# EAGLE board design (EAGLE 7.7.0)
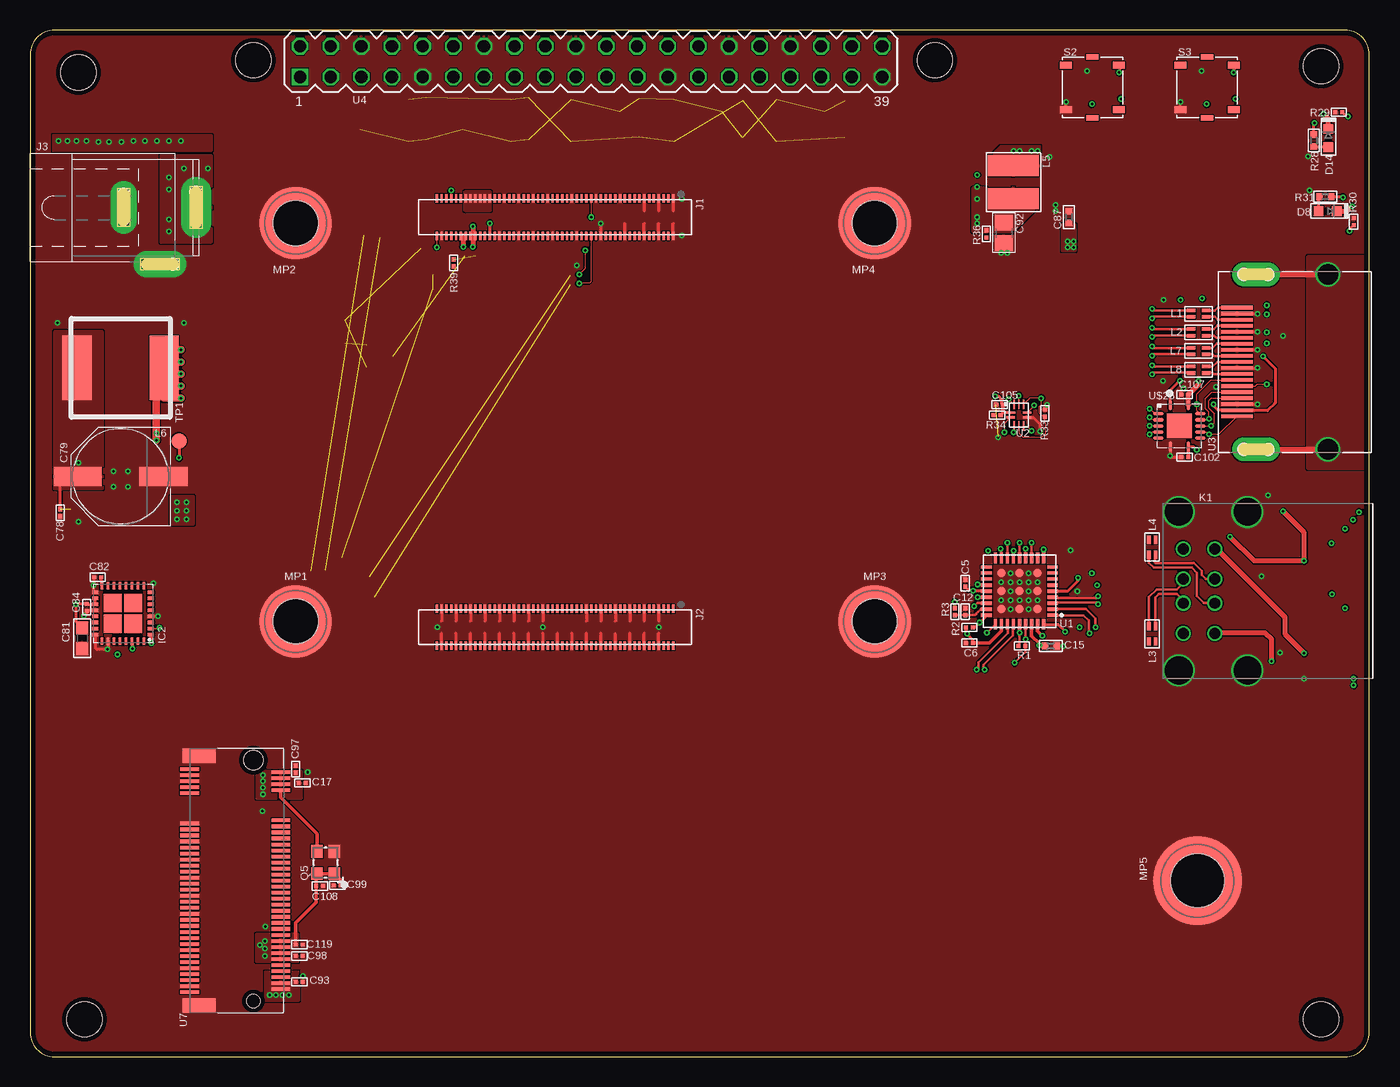
[diagram p17: board, top side]
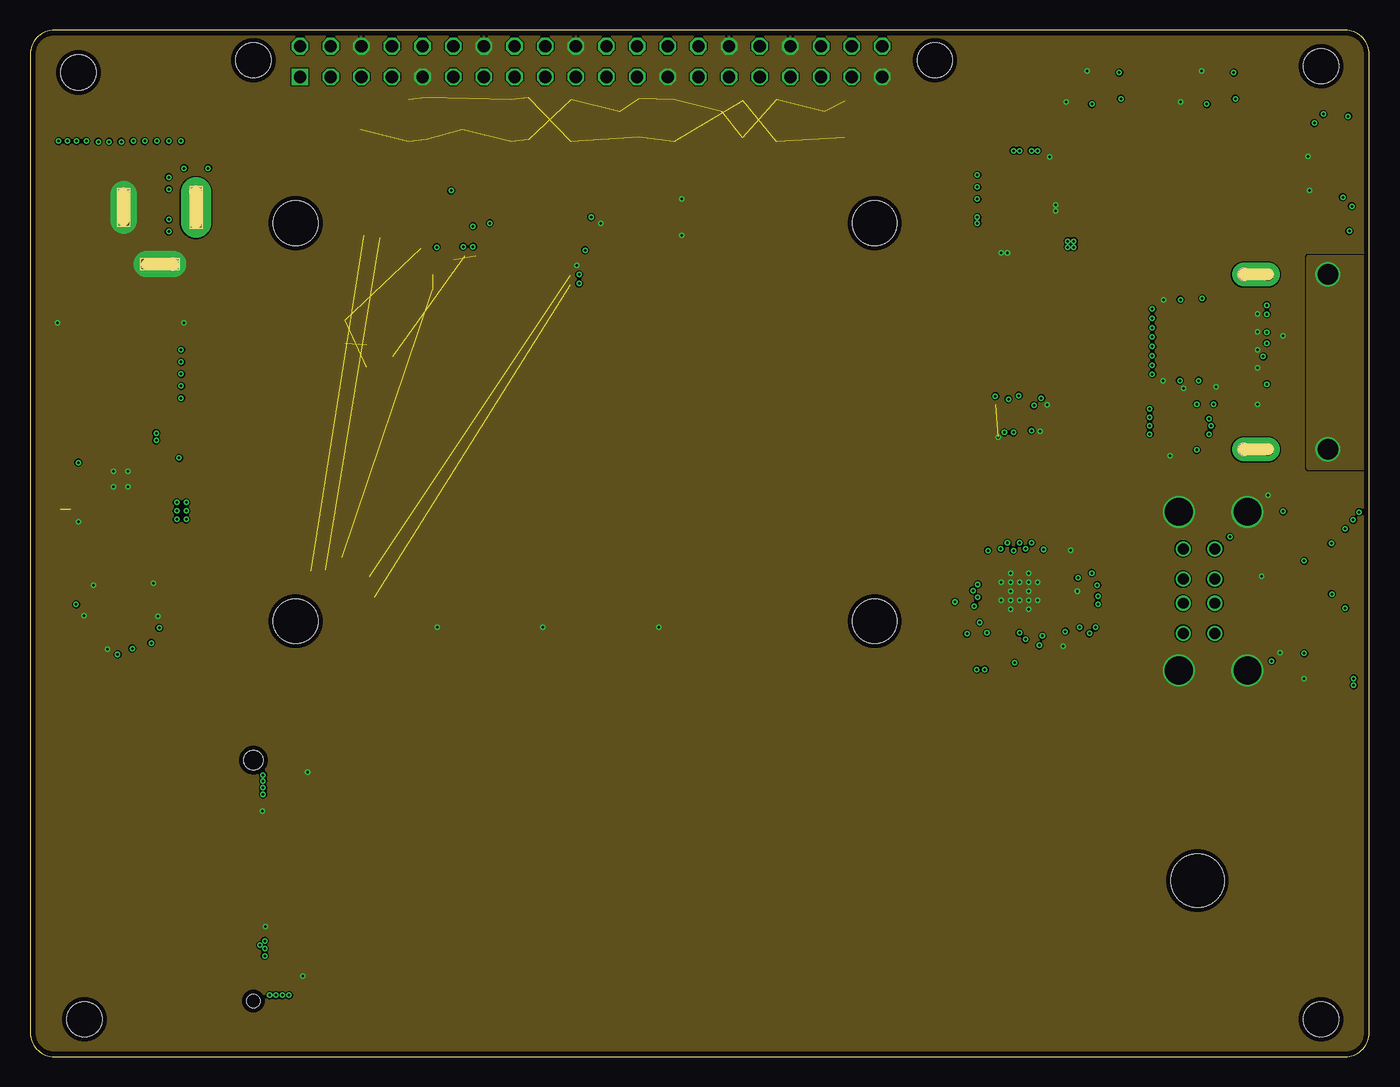
[diagram p18: board, inner layer GND]
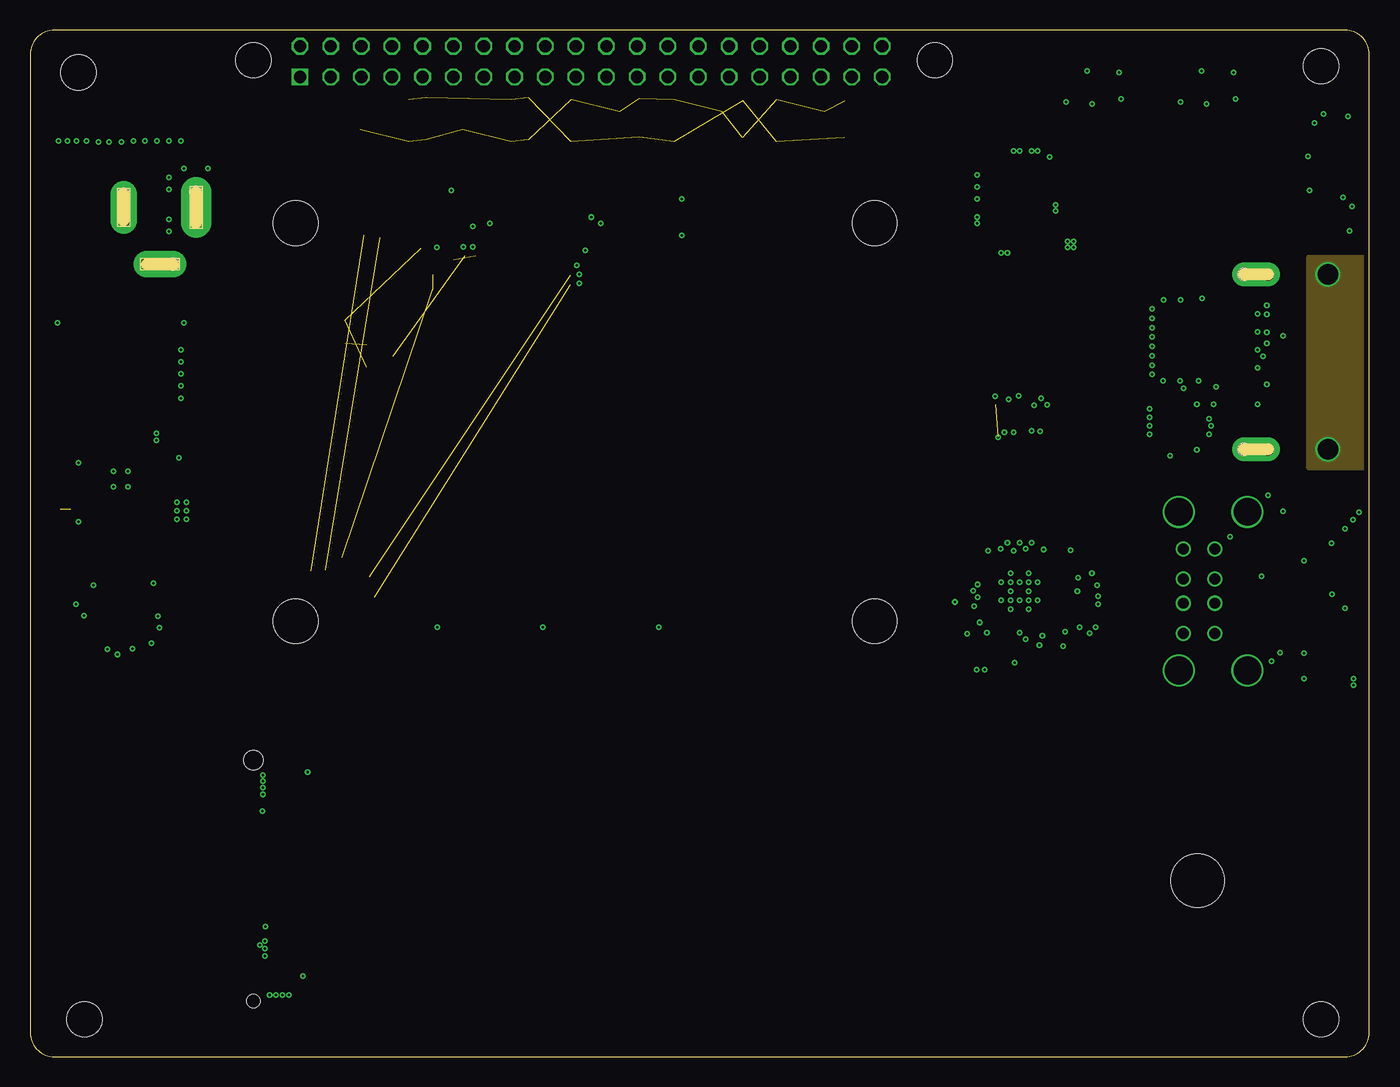
[diagram p19: board, inner layer S3]
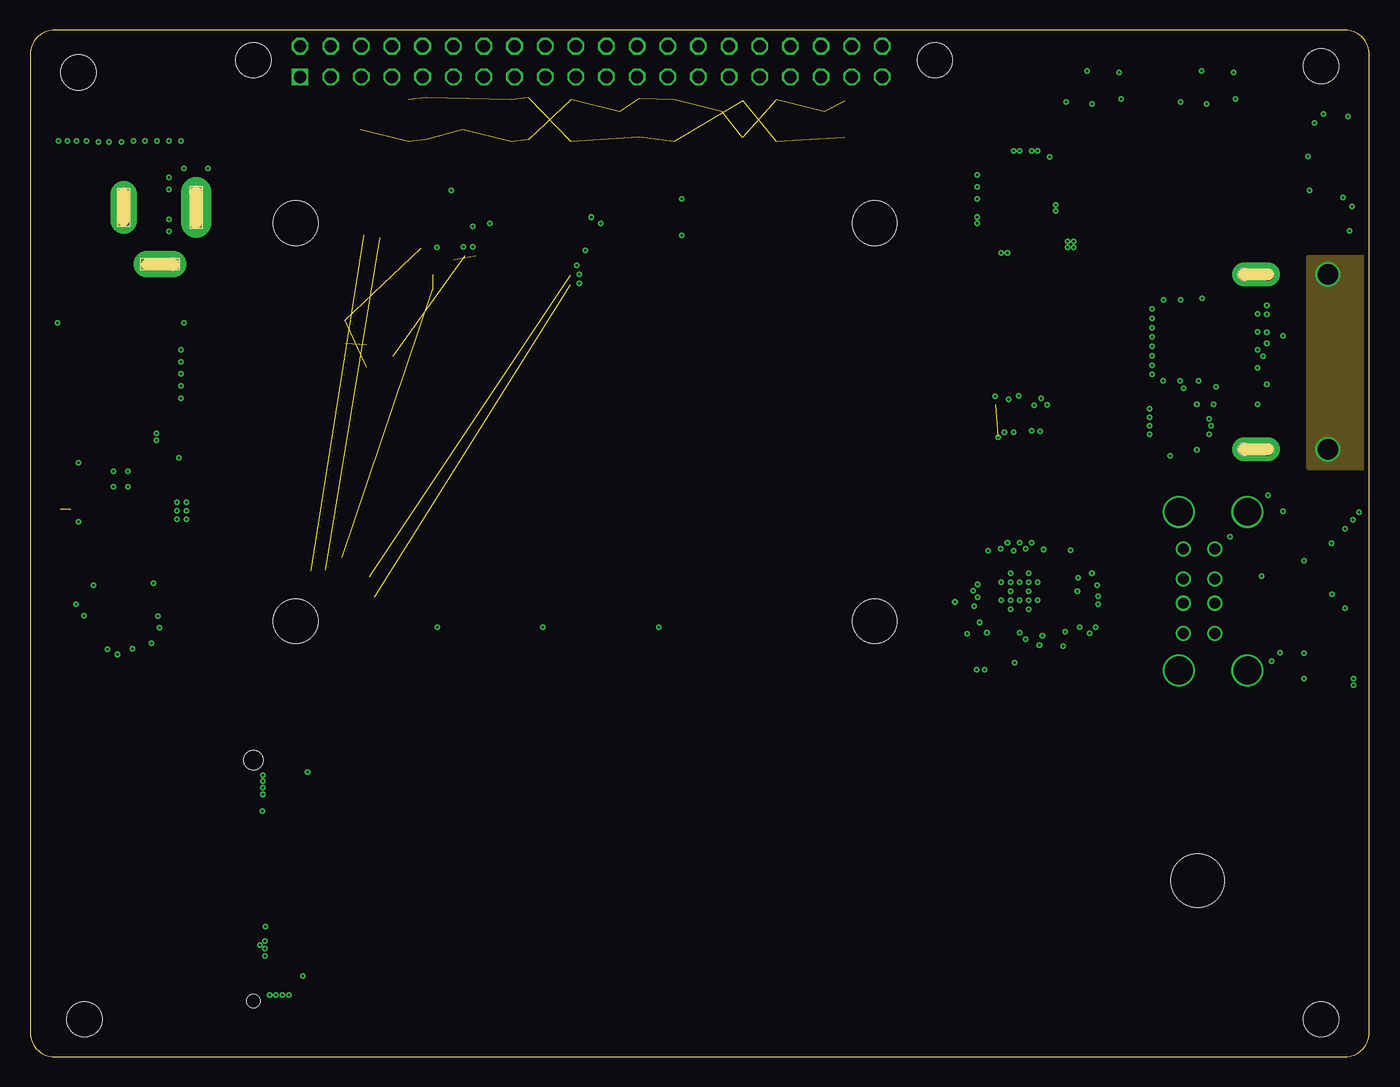
[diagram p20: board, inner layer S14]
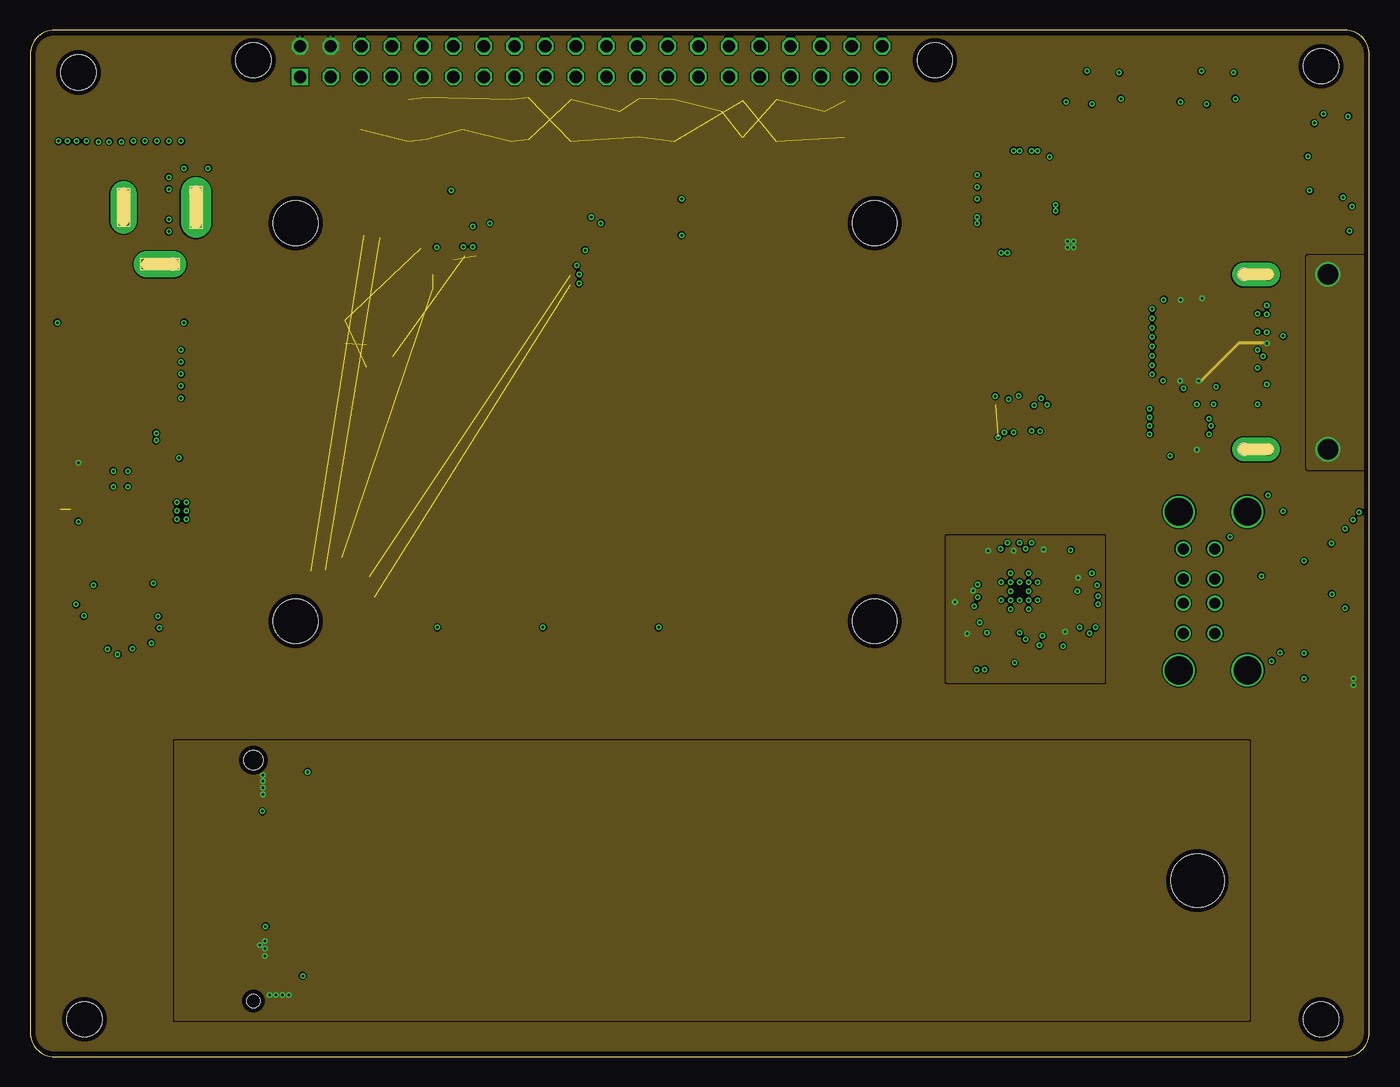
[diagram p21: board, inner layer Power]
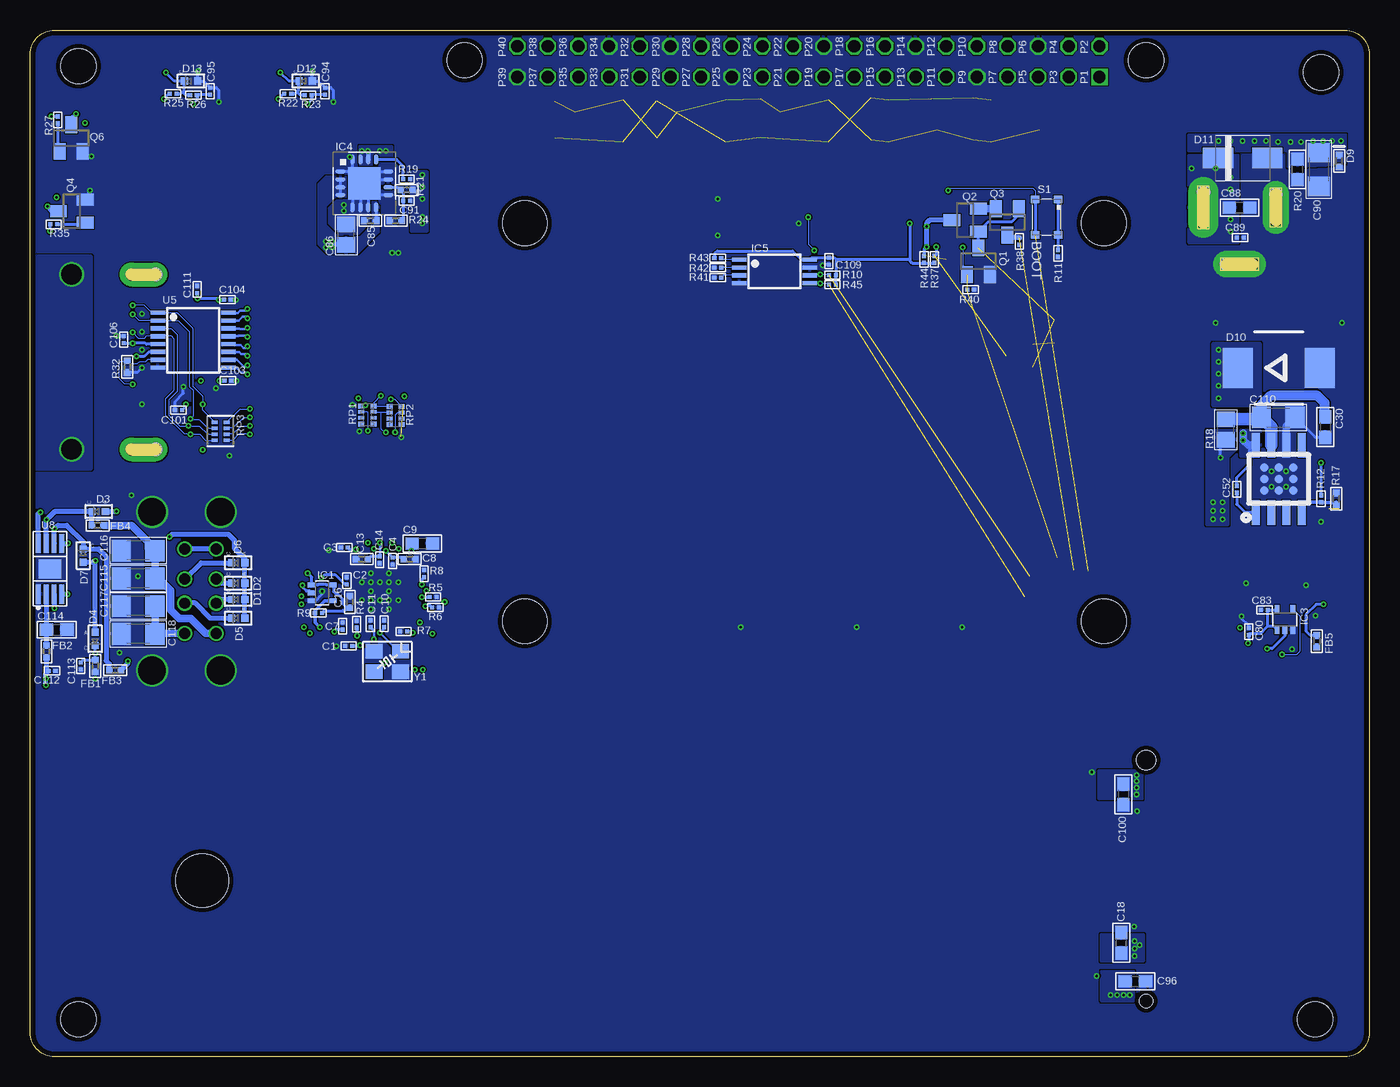
[diagram p22: board, bottom side, seen from below]

Size 111 x 85.1 mm. Coordinates in mm from the lower left corner, seen from the top.
Outline: 2,0 109,0 arc90 111,2 111,83.1 arc90 109,85.1 2,85.1 arc90 0,83.1 0,2 arc90 2,0
Copper layers (1+2*3+14*15+16): Top 0.035mm / dielectric 0.2mm / GND 0.035mm / dielectric 0.2mm / S3 0.035mm / dielectric 0.2mm / S14 0.035mm / dielectric 0.2mm / Power 0.035mm / dielectric 0.2mm / Bottom 0.035mm
Design rules "geppetto": minimum track width 4mil, minimum drill 8mil, track to track 4mil, track to pad 0.15mm, pad to pad 0.15mm, via to via 0.15mm, smd to smd 0mil, copper to edge 15mil, drill to drill 10mil, minimum pad ring 7mil, minimum via ring 5mil, stop-mask expansion 3mil, vias tented up to drill 20mil, thermal gap 0mil
Net classes: 1 supply: width 0.254 mm; 2 analog: width 0.178 mm; 5 USB: width 0.2 mm, clearance 0.2 mm; 6 HDMI: width 0.2 mm, clearance 0.3 mm; 7 50_OHM: width 0.378 mm, clearance 0.3 mm; 4 xxwide: width 0.203 mm
vRestrict: area 78.5,66.6 to 88,76.1

## Footprints (pad centres in the part's own frame; a part is rotated, then mirrored left to right if it is on the bottom)
0201 = smd 0.356 x 0.33: 1 -0.292,0; 2 0.292,0
0402 = smd 0.559 x 0.559: 1 -0.483,0; 2 0.483,0
0603 = smd 1.1 x 1: 1 -0.85,0; 2 0.85,0
PANASONIC_F = smd 4 x 1.6: + 3.55,0; - -3.55,0
0805 = smd 1.3 x 1.5: 1 -0.85,0; 2 0.85,0
1206 = smd 1.6 x 1.8: 1 -1.4,0; 2 1.4,0
D0402 = smd 0.6 x 0.6: P1 0,-0.55; P2 0,0.55
D0603 = smd 0.8 x 0.8: A -0.75,0; C 0.75,0
TPD1E = smd 0.559 x 0.559: 1 -0.483,0; 2 0.483,0
DO-214AB = smd 2.5 x 3.3: A 3.4,0; C -3.4,0
SMAJ = smd 2.5 x 1.7: A 2.032,0; C -2.032,0
SC70-5 = smd 0.4 x 0.7: 1 -0.65,-0.85; 2 0,-0.85; 3 0.65,-0.85; 4 0.65,0.85; 5 -0.65,0.85
QFN32 = smd 0.6 x 0.3: 1 -2.3,1.75; 2 -2.3,1.25; 3 -2.3,0.75; 4 -2.3,0.25; 5 -2.3,-0.25; 6 -2.3,-0.75; 7 -2.3,-1.25; 8 -2.3,-1.75; 17 2.3,-1.75; 18 2.3,-1.25; 19 2.3,-0.75; 20 2.3,-0.25; 21 2.3,0.25; 22 2.3,0.75; 23 2.3,1.25; 24 2.3,1.75 | smd 0.3 x 0.6: 9 -1.75,-2.3; 10 -1.25,-2.3; 11 -0.75,-2.3; 12 -0.25,-2.3; 13 0.25,-2.3; 14 0.75,-2.3; 15 1.25,-2.3; 16 1.75,-2.3; 25 1.75,2.3; 26 1.25,2.3; 27 0.75,2.3; 28 0.25,2.3; 29 -0.25,2.3; 30 -0.75,2.3; 31 -1.25,2.3; 32 -1.75,2.3 | smd 1.5 x 1.5: EXP1 -0.85,0.85; EXP2 0.85,0.85; EXP3 -0.85,-0.86; EXP4 0.85,-0.85
PQFP16 = smd 0.85 x 0.35: 1 -1.975,0.975; 2 -1.975,0.325; 3 -1.975,-0.325; 4 -1.975,-0.975; 9 1.975,-0.975; 10 1.975,-0.325; 11 1.975,0.325; 12 1.975,0.975 | smd 0.35 x 0.85: 5 -0.975,-1.975; 6 -0.325,-1.975; 7 0.325,-1.975; 8 0.975,-1.975; 13 0.975,1.975; 14 0.325,1.975; 15 -0.325,1.975; 16 -0.975,1.975 | smd 2.7 x 2.7: P$1 0,0
TSSOP8 = smd 0.35 x 1.2: 1 -0.975,-2.925; 2 -0.325,-2.925; 3 0.325,-2.925; 4 0.975,-2.925; 5 0.975,2.925; 6 0.325,2.925; 7 -0.325,2.925; 8 -0.975,2.925
HRS_DF40C-100DS-0.4V(51) = smd 0.2 x 0.7: 1 -9.8,-1.54; 2 -9.8,1.54; 3 -9.4,-1.54; 4 -9.4,1.54; 5 -9,-1.54; 6 -9,1.54; 7 -8.6,-1.54; 8 -8.6,1.54; 9 -8.2,-1.54; 10 -8.2,1.54; 11 -7.8,-1.54; 12 -7.8,1.54; 13 -7.4,-1.54; 14 -7.4,1.54; 15 -7,-1.54; 16 -7,1.54; 17 -6.6,-1.54; 18 -6.6,1.54; 19 -6.2,-1.54; 20 -6.2,1.54; 21 -5.8,-1.54; 22 -5.8,1.54; 23 -5.4,-1.54; 24 -5.4,1.54; 25 -5,-1.54; 26 -5,1.54; 27 -4.6,-1.54; 28 -4.6,1.54; 29 -4.2,-1.54; 30 -4.2,1.54; 31 -3.8,-1.54; 32 -3.8,1.54; 33 -3.4,-1.54; 34 -3.4,1.54; 35 -3,-1.54; 36 -3,1.54; 37 -2.6,-1.54; 38 -2.6,1.54; 39 -2.2,-1.54; 40 -2.2,1.54; 41 -1.8,-1.54; 42 -1.8,1.54; 43 -1.4,-1.54; 44 -1.4,1.54; 45 -1,-1.54; 46 -1,1.54; 47 -0.6,-1.54; 48 -0.6,1.54; 49 -0.2,-1.54; 50 -0.2,1.54; 51 0.2,-1.54; 52 0.2,1.54; 53 0.6,-1.54; 54 0.6,1.54; 55 1,-1.54; 56 1,1.54; 57 1.4,-1.54; 58 1.4,1.54; 59 1.8,-1.54; 60 1.8,1.54; 61 2.2,-1.54; 62 2.2,1.54; 63 2.6,-1.54; 64 2.6,1.54; 65 3,-1.54; 66 3,1.54; 67 3.4,-1.54; 68 3.4,1.54; 69 3.8,-1.54; 70 3.8,1.54; 71 4.2,-1.54; 72 4.2,1.54; 73 4.6,-1.54; 74 4.6,1.54; 75 5,-1.54; 76 5,1.54; 77 5.4,-1.54; 78 5.4,1.54; 79 5.8,-1.54; 80 5.8,1.54; 81 6.2,-1.54; 82 6.2,1.54; 83 6.6,-1.54; 84 6.6,1.54; 85 7,-1.54; 86 7,1.54; 87 7.4,-1.54; 88 7.4,1.54; 89 7.8,-1.54; 90 7.8,1.54; 91 8.2,-1.54; 92 8.2,1.54; 93 8.6,-1.54; 94 8.6,1.54; 95 9,-1.54; 96 9,1.54; 97 9.4,-1.54; 98 9.4,1.54; 99 9.8,-1.54; 100 9.8,1.54
PJ-002A = drill 1 pad 2.54 offset: 1 3,-1.27 | drill 1 pad 2.184 offset: 2 -3,-1.09; 3 -1.09,-4.7 | hole 1: 3,1.27; -3,1.09; 1.09,-4.7
61400826021 = drill 2.3 round: 5 -6.57,5.68; 6 -6.57,0; 7 6.57,0; 8 6.57,5.68 | drill 0.9 round: A1 -3.5,5.33; A2 -1,5.33; A3 1,5.33; A4 3.5,5.33; B1 -3.5,2.71; B2 -1,2.71; B3 1,2.71; B4 3.5,2.71
0504-DLP11S = smd 0.7 x 0.3: 1 -0.625,0.275; 2 0.625,0.275; 3 0.625,-0.275; 4 -0.625,-0.275
1515 = smd 1.75 x 4.2: 1 -1.375,0; 2 1.375,0
3232DZ = smd 2.413 x 5.334: 1 -3.619,0; 2 3.619,0
WA-SMSI_9774___151 = smd 6 x 6: 1 0,0 | hole 3.7: 0,0
WA-SMSI_9774___360 = smd 7.4 x 7.4: 1 0,0 | hole 4.4: 0,0
SOT23 = smd 1 x 1.4: 1 -0.95,-1.1; 2 0.95,-1.1; 3 0,1.1
VLGA-4 = smd 1.05 x 0.95: 1 -0.925,-0.725; 2 0.925,-0.725; 3 0.925,0.725; 4 -0.925,0.725
RP741X083 = smd 0.4 x 0.5: 1 -0.75,-0.5; 4 0.75,-0.5; 5 0.75,0.5; 8 -0.75,0.5 | smd 0.3 x 0.5: 2 -0.25,-0.5; 3 0.25,-0.5; 6 0.25,0.5; 7 -0.25,0.5
741X08 = smd 0.3 x 0.5: 1 -0.75,-0.5; 2 -0.25,-0.5; 3 0.25,-0.5; 4 0.75,-0.5; 5 0.75,0.5; 6 0.25,0.5; 7 -0.25,0.5; 8 -0.75,0.5
KMT0 = smd 0.65 x 0.7: 1 -1.475,0.95; 2 1.475,0.95; 3 1.475,-0.95; 4 -1.475,-0.95
EVQ = smd 0.6 x 1: A@1 -1.85,2.2; A@2 -1.85,-2.2; B@1 1.85,2.2; B@2 1.85,-2.2 | smd 0.45 x 1: G@1 -2.525,0; G@2 2.525,0
TP0500 = smd 1.27 x 1.27: 1 0,0
QFN36-6X6MM = smd 0.9 x 0.28: 1 -2.75,2; 2 -2.75,1.5; 3 -2.75,1; 4 -2.75,0.5; 5 -2.75,0; 6 -2.75,-0.5; 7 -2.75,-1; 8 -2.75,-1.5; 9 -2.75,-2; 19 2.75,-2; 20 2.75,-1.5; 21 2.75,-1; 22 2.75,-0.5; 23 2.75,0; 24 2.75,0.5; 25 2.75,1; 26 2.75,1.5; 27 2.75,2 | smd 0.28 x 0.9: 10 -2,-2.75; 11 -1.5,-2.75; 12 -1,-2.75; 13 -0.5,-2.75; 14 0,-2.75; 15 0.5,-2.75; 16 1,-2.75; 17 1.5,-2.75; 18 2,-2.75; 28 2,2.75; 29 1.5,2.75; 30 1,2.75; 31 0.5,2.75; 32 0,2.75; 33 -0.5,2.75; 34 -1,2.75; 35 -1.5,2.75; 36 -2,2.75 | smd 0.7 x 0.7: EPAD 0,0; EXP1 1.5,0; EXP2 -1.5,0; EXP3 0,1.5; EXP4 0,-1.5; EXP5 1.5,-1.5; EXP6 -1.5,-1.5; EXP7 -1.5,1.5; EXP8 1.5,1.5
UQFN-10 = smd 0.2 x 0.8: 1 -0.2,-0.7; 2 0.2,-0.7; 6 0.2,0.7; 7 -0.2,0.7 | smd 0.8 x 0.2: 3 0.9,-0.4; 4 0.9,0; 5 0.9,0.4; 8 -0.9,0.4; 9 -0.9,0; 10 -0.9,-0.4
47151-001 = smd 0.3 x 2.6: 1 4.5,1.56; 2 4,1.56; 3 3.5,1.56; 4 3,1.56; 5 2.5,1.56; 6 2,1.56; 7 1.5,1.56; 8 1,1.56; 9 0.5,1.56; 10 0,1.56; 11 -0.5,1.56; 12 -1,1.56; 13 -1.5,1.56; 14 -2,1.56; 15 -2.5,1.56; 16 -3,1.56; 17 -3.5,1.56; 18 -4,1.56; 19 -4.5,1.56 | drill 1.7 round: G1 -7.25,-5.96; G2 7.25,-5.96 | drill 1 pad 2 offset: G3 7.25,-1; G4 -7.25,-1 | hole 1: -7.25,1; 7.25,1
2X20 = drill 1.016 square: 1 24.13,1.27 | drill 1.016 octagon: 2 24.13,-1.27; 3 21.59,1.27; 4 21.59,-1.27; 5 19.05,1.27; 6 19.05,-1.27; 7 16.51,1.27; 8 16.51,-1.27; 9 13.97,1.27; 10 13.97,-1.27; 11 11.43,1.27; 12 11.43,-1.27; 13 8.89,1.27; 14 8.89,-1.27; 15 6.35,1.27; 16 6.35,-1.27; 17 3.81,1.27; 18 3.81,-1.27; 19 1.27,1.27; 20 1.27,-1.27; 21 -1.27,1.27; 22 -1.27,-1.27; 23 -3.81,1.27; 24 -3.81,-1.27; 25 -6.35,1.27; 26 -6.35,-1.27; 27 -8.89,1.27; 28 -8.89,-1.27; 29 -11.43,1.27; 30 -11.43,-1.27; 31 -13.97,1.27; 32 -13.97,-1.27; 33 -16.51,1.27; 34 -16.51,-1.27; 35 -19.05,1.27; 36 -19.05,-1.27; 37 -21.59,1.27; 38 -21.59,-1.27; 39 -24.13,1.27; 40 -24.13,-1.27
TSSOP16 = smd 1.2 x 0.35: 1 -2.925,2.275; 2 -2.925,1.625; 3 -2.925,0.975; 4 -2.925,0.325; 5 -2.925,-0.325; 6 -2.925,-0.975; 7 -2.925,-1.625; 8 -2.925,-2.275; 9 2.925,-2.275; 10 2.925,-1.625; 11 2.925,-0.975; 12 2.925,-0.325; 13 2.925,0.325; 14 2.925,0.975; 15 2.925,1.625; 16 2.925,2.275
8SO_POWERPAD = smd 2.05 x 0.66: 1 -2.79,1.905; 2 -2.79,0.635; 3 -2.79,-0.635; 4 -2.79,-1.905; 5 2.79,-1.905; 6 2.79,-0.635; 7 2.79,0.635; 8 2.79,1.905 | smd 0.7 x 0.7: 9 0,0; PWRPAD1 -0.95,1.2; PWRPAD2 0,1.2; PWRPAD3 0.95,1.2; PWRPAD4 -0.95,0; PWRPAD5 0.95,0; PWRPAD6 -0.95,-1.2; PWRPAD7 0,-1.2; PWRPAD8 0.95,-1.2
2199230_KEY_M = smd 0.3 x 1.55: 1 -9.25,5.275; 2 -9,-2.275; 3 -8.75,5.275; 4 -8.5,-2.275; 5 -8.25,5.275; 6 -8,-2.275; 7 -7.75,5.275; 8 -7.5,-2.275; 9 -7.25,5.275; 10 -7,-2.275; 11 -6.75,5.275; 12 -6.5,-2.275; 13 -6.25,5.275; 14 -6,-2.275; 15 -5.75,5.275; 16 -5.5,-2.275; 17 -5.25,5.275; 18 -5,-2.275; 19 -4.75,5.275; 20 -4.5,-2.275; 21 -4.25,5.275; 22 -4,-2.275; 23 -3.75,5.275; 24 -3.5,-2.275; 25 -3.25,5.275; 26 -3,-2.275; 27 -2.75,5.275; 28 -2.5,-2.275; 29 -2.25,5.275; 30 -2,-2.275; 31 -1.75,5.275; 32 -1.5,-2.275; 33 -1.25,5.275; 34 -1,-2.275; 35 -0.75,5.275; 36 -0.5,-2.275; 37 -0.25,5.275; 38 0,-2.275; 39 0.25,5.275; 40 0.5,-2.275; 41 0.75,5.275; 42 1,-2.275; 43 1.25,5.275; 44 1.5,-2.275; 45 1.75,5.275; 46 2,-2.275; 47 2.25,5.275; 48 2.5,-2.275; 49 2.75,5.275; 50 3,-2.275; 51 3.25,5.275; 52 3.5,-2.275; 53 3.75,5.275; 54 4,-2.275; 55 4.25,5.275; 56 4.5,-2.275; 57 4.75,5.275; 58 5,-2.275; 67 7.25,5.275; 68 7.5,-2.275; 69 7.75,5.275; 70 8,-2.275; 71 8.25,5.275; 72 8.5,-2.275; 73 8.75,5.275; 74 9,-2.275; 75 9.25,5.275 | smd 1.2 x 2.75: P$1 -10.35,4.5; P$2 10.35,4.5 | hole 1.1: -10,0 | hole 1.6: 10,0
MSOP8-PAD = smd 0.4 x 1.6: 1 -0.975,-2.1; 2 -0.325,-2.1; 3 0.325,-2.1; 4 0.975,-2.1; 5 0.975,2.1; 6 0.325,2.1; 7 -0.325,2.1; 8 -0.975,2.1 | smd 1.89 x 1.57: TP 0,0
GEPPETTO_HOLE_2.9 = hole 2.9: 0,0
S-PVQFN-N14 = smd 0.85 x 0.28: 1 -1.725,-0.75; 7 1.725,-0.75; 8 1.725,0.75; 14 -1.725,0.75 | smd 0.28 x 0.85: 2 -1,-1.725; 3 -0.5,-1.725; 4 0,-1.725; 5 0.5,-1.725; 6 1,-1.725; 9 1,1.725; 10 0.5,1.725; 11 0,1.725; 12 -0.5,1.725; 13 -1,1.725 | smd 2.05 x 2.05: PAD 0,0
CRYSTAL-3225 = smd 1.4 x 1.2: 1 -1.1,-0.85; 2 1.1,-0.85; 3 1.1,0.85; 4 -1.1,0.85

## Placement (x,y rotation side)
C1  GRM033R60J104KE19D  [0201]  84.6,34.05 180 bottom
C2  GRM033R60J104KE19D  [0201]  84.75,39.45 90 bottom
C3  GRM033R60J104KE19D  [0201]  84.95,42.2 180 bottom
C4  GRM033R60J104KE19D  [0201]  80.95,41.1 270 bottom
C5  GRM033R60J104KE19D  [0201]  77.5,39.25 90 top
C6  GRM033R60J104KE19D  [0201]  77.85,34.3 180 top
C7  GRM033R60J104KE19D  [0201]  85.1,35.7 90 bottom
C8  GRM155R61A105KE15D  [0402]  79.55,41.25 0 bottom
C9  CGB3B1X5R1A475K055AC  [0603]  78.5,42.55 0 bottom
C10  CC0201JRNPO9BN220  [0201]  81.65,35.9 90 bottom
C11  CC0201JRNPO9BN220  [0201]  82.8,35.9 90 bottom
C12  GRM033R60J104KE19D  [0201]  77.5,36.9 90 top
C13  GRM155R61A105KE15D  [0402]  83.5,41.25 180 bottom
C14  GRM033R60J104KE19D  [0201]  82.05,41.2 270 bottom
C15  GRM155R61A105KE15D  [0402]  84.6,34.05 0 top
C16  DNP  [0402]  84.5,37.7 90 bottom
C17  GRM033R60J104KE19D  [0201]  22.55,22.7 0 top
C18  C1608X5R0J106M080AB  [0603]  20.55,9.45 90 bottom
C30  C0603C103K5RACTU  [0603]  3.65,52.2 270 bottom
C52  C0603X5R1A103K030BA  [0201]  11,47.05 90 bottom
C78  C0603X5R1A103K030BA  [0201]  2.5,45.1 270 top
C79  EEE-1CA331UP  [PANASONIC_F]  7.5,48.1 180 top
C80  GRM033R60J104KE19D  [0201]  10,35.25 90 bottom
C81  CGB3B1X5R1A475K055AC  [0603]  4.3,34.7 270 top
C82  GRM033R60J104KE19D  [0201]  5.6,39.75 180 top
C83  GRM033R60J104KE19D  [0201]  8.7,37.05 180 bottom
C84  GRM033R60J104KE19D  [0201]  4.7,37.25 270 top
C85  EMK105B7104KV-F  [0402]  82.8,69.3 180 bottom
C86  EMK212BJ106KG-T  [0805]  84.8,68.15 90 bottom
C87  GRM155R61A105KE15D  [0402]  86.1,69.6 90 top
C88  C1608X5R0J106M080AB  [0603]  10.75,70.4 0 bottom
C89  GRM033R60J104KE19D  [0201]  10.7,67.9 0 bottom
C90  0.1uF 100V  [1206]  4.2,73.55 270 bottom
C91  UMK063CG100DT-F  [0201]  79.8,70.95 180 bottom
C92  CL21A226MQCLQNC  [0805]  80.7,68.3 270 top
C93  GRM033R60J104KE19D  [0201]  22.3,6.2 0 top
C94  C0603C0G1H470J030BA  [0201]  86.57,80.04 90 bottom
C95  C0603C0G1H470J030BA  [0201]  96.07,80.04 90 bottom
C96  C1608X5R0J106M080AB  [0603]  19.4,6.25 0 bottom
C97  GRM033R60J104KE19D  [0201]  22,23.85 90 top
C98  GRM033R60J104KE19D  [0201]  22.3,8.35 0 top
C99  GRM033R60J104KE19D  [0201]  25.45,14.2 180 top
C100  C1608X5R0J106M080AB  [0603]  20.4,21.75 270 bottom
C101  GRM033R60J104KE19D  [0201]  98.7,53.6 180 bottom
C102  GRM033R60J104KE19D  [0201]  95.7,49.7 180 top
C103  C0603X5R1A103K030BA  [0201]  94.6,56.05 0 bottom
C104  C0603X5R1A103K030BA  [0201]  94.65,62.75 0 bottom
C105  GRM033R60J104KE19D  [0201]  80.35,54.05 180 top
C106  GRM033R60J104KE19D  [0201]  103.25,59.45 90 bottom
C107  GRM033R60J104KE19D  [0201]  95.7,54.9 180 top
C108  C0603X5R1A103K030BA  [0201]  24,14.15 0 top
C109  GRM033R60J104KE19D  [0201]  44.8,65.95 270 bottom
C110  CL31A106KBHNNNE  [1206]  7.55,53 0 bottom
C111  GRM033R60J104KE19D  [0201]  97.15,63.6 90 bottom
C112  GRM033R60J104KE19D  [0201]  109.2,32 0 bottom
C113  C0603X5R1A103K030BA  [0201]  106.8,32.4 270 bottom
C114  C1608X5R0J106M080AB  [0603]  108.8,35.4 0 bottom
C115  DNP  [1206]  102.05,39.65 180 bottom
C116  GRM31CR60J227ME11L  [1206]  102.05,41.95 180 bottom
C117  DNP  [1206]  102.05,37.35 180 bottom
C118  GRM31CR60J227ME11L  [1206]  102.05,35.05 180 bottom
C119  GRM033R60J104KE19D  [0201]  22.3,9.3 0 top
D1  PS04LTVA1  [D0402]  93.75,37.9 90 bottom
D2  PS04LTVA1  [D0402]  93.75,39.25 90 bottom
D3  B72590D0050A060  [D0402]  105.3,45.2 90 bottom
D4  B72590D0050A060  [D0402]  105.6,34.65 180 bottom
D5  PS04LTVA1  [D0402]  93.75,36.35 90 bottom
D6  PS04LTVA1  [D0402]  93.75,40.95 90 bottom
D7  B72590D0050A060  [D0402]  106.6,41.55 0 bottom
D8  150060GS75000  [D0603]  107.55,70.1 0 top
D9  DNP  [TPD1E]  2.5,74.25 270 bottom
D10  CDBC540-G  [DO-214AB]  7.5,57.1 0 bottom
D11  824501401  [SMAJ]  10.5,74.49 0 bottom
D12  B72590D0050A060  [D0402]  88.16,80.88 90 bottom
D13  B72590D0050A060  [D0402]  97.66,80.88 90 bottom
D14  150060RS75000  [D0603]  107.6,76.15 90 top
FB1  BLM15PX121SN1D  [0402]  105.6,32.4 90 bottom
FB2  BLM15PX121SN1D  [0402]  109.65,33.6 90 bottom
FB3  BLM15PX121SN1D  [0402]  103.95,32.05 180 bottom
FB4  BLM15PX121SN1D  [0402]  105.4,44.05 180 bottom
FB5  BLM15PX121SN1D  [0402]  4.35,34.45 90 bottom
IC1  DNP  [SC70-5]  86.8,38.45 270 bottom
IC2  FT232RQ-REEL  [QFN32]  7.7,36.75 180 top
IC3  SN74LV1T126DCKR  [SC70-5]  7,36.25 0 bottom
IC4  TPS62111  [PQFP16]  83.3,72.4 0 bottom
IC5  CAT24C256YI-GT3  [TSSOP8]  49.3,65.1 270 bottom
J1  DF40C-100DS-0.4V(51)  [HRS_DF40C-100DS-0.4V(51)]  43.5,69.6 180 top
J2  DF40C-100DS-0.4V(51)  [HRS_DF40C-100DS-0.4V(51)]  43.5,35.6 180 top
J3  PJ-002AH  [PJ-002A]  10.75,70.4 0 top
K1  61400826021  [61400826021]  100.9,38.6 90 top
L1  7442335900  [0504-DLP11S]  96.85,61.6 180 top
L2  7442335900  [0504-DLP11S]  96.85,60.05 180 top
L3  7442335900  [0504-DLP11S]  93,35.05 270 top
L4  7442335900  [0504-DLP11S]  93,42.25 90 top
L5  LQH44PN6R8MP0L  [1515]  81.5,72.5 270 top
L6  IHLP3232DZER100M11  [3232DZ]  7.5,57.1 180 top
L7  7442335900  [0504-DLP11S]  96.85,58.5 180 top
L8  7442335900  [0504-DLP11S]  96.85,56.95 180 top
MP1  9774015151R  [WA-SMSI_9774___151]  22,36.1 0 top
MP2  9774015151R  [WA-SMSI_9774___151]  22,69.1 0 top
MP3  9774015151R  [WA-SMSI_9774___151]  70,36.1 0 top
MP4  9774015151R  [WA-SMSI_9774___151]  70,69.1 0 top
MP5  9774025360R  [WA-SMSI_9774___360]  96.75,14.6 90 top
Q1  BSS138  [SOT23]  32.4,65.95 0 bottom
Q2  FDN360P  [SOT23]  33.5,69.35 90 bottom
Q3  FDN360P  [SOT23]  30,69.2 180 bottom
Q4  BSS138  [SOT23]  107.55,70.1 90 bottom
Q5  KC2520B32K7680CM2E00  [VLGA-4]  24.5,16.1 90 top
Q6  BSS138  [SOT23]  107.6,76.15 0 bottom
R1  RMCF0201FT1M00  [0201]  82.2,34.05 0 top
R2  CRCW0201100KFNED  [0201]  77.85,35.6 0 top
R3  CRCW0201100KFNED  [0201]  76.65,36.9 90 top
R4  RC0201FR-0712KL  [0201]  83.95,35.85 270 bottom
R5  CRCW0201100KFNED  [0201]  77.6,38.1 180 bottom
R6  CRCW0201100KFNED  [0201]  77.4,37.25 180 bottom
R7  CRCW0201100KFNED  [0201]  80.05,35.25 0 bottom
R8  CRCW0201100KFNED  [0201]  78.35,40.05 270 bottom
R9  RC0201JR-070RL  [0201]  87.1,36.8 0 bottom
R10  RC0201FR-071K5L  [0201]  44.5,64.8 0 bottom
R11  ERJ-1GEF1002C  [0201]  25.8,66.6 90 bottom
R12  CRCW0201100KFNED  [0201]  4,46.25 270 bottom
R17  ERJ-2RKF3162X  [0402]  2.75,46.25 90 bottom
R18  MCR10EZPJ000  [0805]  11.9,52 90 bottom
R19  RMCF0201FT1M00  [0201]  79.8,72.75 0 bottom
R20  311-330GRTR-ND  [0603]  5.95,73.55 90 bottom
R21  MCR01MRTJ000  [0402]  79.8,71.85 0 bottom
R22  ERJ-1GEF1002C  [0201]  89.65,79.82 180 bottom
R23  ERJ-1GEF1500C  [0201]  87.96,79.71 0 bottom
R24  DNP  [0402]  80.7,69.3 0 bottom
R25  ERJ-1GEF1002C  [0201]  99.15,79.82 180 bottom
R26  ERJ-1GEF1500C  [0201]  97.46,79.71 0 bottom
R27  ERJ-1GNJ102C  [0201]  108.7,77.65 270 bottom
R28  ERJ-2RKF3000X  [0402]  106.4,75.95 90 top
R29  CRCW0201100KFNED  [0201]  108.47,78.29 0 top
R30  CRCW0201100KFNED  [0201]  109.69,69.23 270 top
R31  ERJ-2RKF3000X  [0402]  107.35,71.3 0 top
R32  CRCW040275R0FKED  [0402]  102.95,57.2 90 bottom
R33  ERJ-1GEF1002C  [0201]  84.1,53.35 270 top
R34  RC0201JR-070RL  [0201]  80.15,53.2 180 top
R35  ERJ-1GNJ102C  [0201]  109.05,69 0 bottom
R36  RC0201JR-070RL  [0201]  79.25,68.2 270 top
R37  DNP  [0201]  36.05,66.1 270 bottom
R38  RC0201JR-070RL  [0201]  29,67.6 90 bottom
R39  RC0201JR-070RL  [0201]  35.1,65.8 270 top
R40  ERJ-1GEF1002C  [0201]  33.05,63.6 180 bottom
R41  CRCW0201100KFNED  [0201]  54,64.6 0 bottom
R42  CRCW0201100KFNED  [0201]  54,65.4 0 bottom
R43  CRCW0201100KFNED  [0201]  54,66.2 0 bottom
R44  RC0201JR-070RL  [0201]  36.9,66.1 270 bottom
R45  RC0201FR-071K5L  [0201]  44.5,64 0 bottom
RP1  DNP  [RP741X083]  83.05,53.2 270 bottom
RP2  DNP  [RP741X083]  80.7,53.15 90 bottom
RP3  DNP  [741X08]  95.2,51.85 90 bottom
S1  KMT021 NGJ LHS  [KMT0]  26.75,69.6 270 bottom
S2  EVQ-PLDA15  [EVQ]  88.05,80.35 90 top
S3  EVQ-PLDA15  [EVQ]  97.55,80.35 90 top
TP1  DNP  [TP0500]  12.35,51.05 0 top
U1  USB2513B-AEZC-TR  [QFN36-6X6MM]  82,38.6 180 top
U2  TS3A5223RSWR  [UQFN-10]  81.95,53.2 270 top
U3  685119134923  [47151-001]  101.6,57.6 90 top
U4  67996-140HLF  [2X20]  46.5,82.5 180 top
U5  TPD13S523PWR  [TSSOP16]  97.5,59.4 0 bottom
U6  TPS5450QDDARQ1  [8SO_POWERPAD]  7.5,47.9 90 bottom
U7  1-2199230-5  [2199230_KEY_M]  18.5,14.6 90 top
U8  TPS2052BDGNR  [MSOP8-PAD]  109.35,40.45 0 bottom
U$12  DNP  [GEPPETTO_HOLE_2.9]  107,82.1 0 top
U$14  DNP  [GEPPETTO_HOLE_2.9]  4,81.6 0 top
U$16  DNP  [GEPPETTO_HOLE_2.9]  107,3.1 0 top
U$18  DNP  [GEPPETTO_HOLE_2.9]  4.5,3.1 0 top
U$26  TXS0104ERGYR  [S-PVQFN-N14]  95.25,52.3 270 top
U$30  DNP  [GEPPETTO_HOLE_2.9]  18.5,82.6 0 top
U$32  DNP  [GEPPETTO_HOLE_2.9]  75,82.6 0 top
Y1  7M-24.000MAAJ-T  [CRYSTAL-3225]  81.4,32.75 180 bottom

## Tracks (layer width: path | path; a pad name or v marks a point on that pad's centre or on a via)
1.8V_OUT$16  (via drill 0.2)  (1 unrouted)
  Top 0.254: 35.9,68.06 J1.88 J1.90
  Top 0.406: 35.9,68.06 v35.9,67.15
  Bottom 0.254: v35.9,67.15 35.9,66.54 R37.1
2.5.0V_VCC_5.0  (via drill 0.2, 0.2 pad 0.25)  (1 unrouted)
  Top 0.254: C78.1 2.5,48.1
  Top 0.406: U$26.14 95.99,54.03 C107.1 96.85,55.76 v96.85,56.05
  Top 0.61: 3.88,48.1 C79.+ 2.5,48.1
  Power 0.254: v102.5,59.15 100.17,59.15 97.08,56.05 v96.85,56.05
  Bottom 0.254: R12.1 v4,49.25 | 82.35,70.4 IC4.8 82.32,70.42 82.32,69.49 C85.1 | IC4.2 IC4.3 IC4.4 | U5.5 101.38,59.08 101.45,59.15 v102.5,59.15 C106.1 | 85,36.9 86.55,36.9 arc-90 R9.2 | v88,40.1 87.65,39.75 IC1.1 87.15,39.1 87.1,39.15 86.5,39.15 86.45,39.1 IC1.5 85.95,39.02 85.85,38.92 85.85,38.55 85.65,38.35 85.5,38.35 85.15,38 85.15,37.6 84.77,37.22 C16.1 84.68,37.22 85,36.9 | 85,36.9 85.1,37
  Bottom 0.406: C86.1 85.8,67.3 v86,67.1 | FB2.1 109.68,33.09 109.68,32.19 C112.1 109.7,31.79 v109.7,31.35 v109.7,30.8
  other vias: 86.5,67.6 86.5,67.1 86,67.6
  pour Top: 6,60.1 2,60.1 2,47.1 6,47.1
  pour Bottom: 82.1,70.9 82.6,70.9 82.6,68.96 83.66,67.9 85.47,67.9 86.5,68.93 86.5,70.52 85.72,71.3 84.8,71.3 84.8,72.9 86.53,72.9 87.1,72.33 87.1,67.37 86.38,66.65 83.84,66.65 82.1,68.39
  pour Power: 85.55,67.85 86.6,67.85 86.6,66.8 85.55,66.8
  pour Top: 85.55,66.8 85.55,69 86.6,69 86.6,66.8
  pour Top (rank 3): 36.05,70.1 36.05,71.75 38.1,71.75 38.1,70.1
  pour Power (rank 6): 0,0 0,85.1 111,85.1 111,0
3.3.3V_VCC_3.3  (via drill 0.2)  (9 unrouted)
  Top 0.254: R28.2 106.4,77.35 v106.45,77.4 | R31.2 108.75,71.3 v108.8,71.25
  Top 0.305: C119.1 22.01,11.11 23.7,12.8 C108.1 23.71,15.11 Q5.4 Q5.1 25.74,14.66 C99.1
  other vias: 78.5,73.1 78.5,72.1 78.5,71.1 78.5,69.6 78.5,69.1 20.35,5.1 20.9,5.1 21.45,5.1 19.45,8.35 19.45,8.95 19.45,9.6 19.3,23.35 19.3,22.85 19.3,22.3 19.85,5.1 19.05,9.25 19.3,21.75
  pour Top: 83.4,72 78.1,72 78.1,68.4 81.47,68.4 83.4,70.33
  pour Bottom: 79.4,73.4 78.1,73.4 78.1,68.4 79.4,68.4
  pour Power (rank 3): 101,3.1 101,26.1 12,26.1 12,3.1
  pour Top: 19.5,4.65 19.5,7.05 22.25,7.05 22.25,4.65
  pour Bottom: 19.5,4.65 19.5,7.05 22.25,7.05 22.25,4.65
  pour Top: 18.75,7.9 22.2,7.9 22.2,10.15 18.75,10.15
  pour Bottom: 18.75,7.9 22.2,7.9 22.2,10.15 18.75,10.15
  pour Top: 18.8,21.4 18.8,23.7 22.45,23.7 22.45,21.4
  pour Bottom: 18.8,21.4 18.8,23.7 22.45,23.7 22.45,21.4
3.3V_OUT$16  (via drill 0.2)  (1 unrouted)
  Top 0.254: 36.7,68.06 J1.86 J1.84 36.7,68.26
  Top 0.406: 36.7,68.06 v36.7,67.15 | v36.7,68.85 36.7,68.26
  Bottom 0.254: v36.7,67.15 36.9,66.95 R44.1
  Bottom 0.406: Q2.3 36.45,69.35 36.7,69.1 v36.7,67.15
3.VLOGIC_VLOGIC  (14 unrouted)
4.5.5-36V_VCC_BATT  (via drill 0.2)
  Top 0.254: TP1.1 v12.35,49.65
  Bottom 0.254: v12.35,49.65 TP1.1 12.35,51.26
  other vias: 12.15,45.95 12.15,45.25 12.95,45.95 12.15,44.55 12.95,45.25 12.95,44.55 11.5,68.4 11.5,69.4 11.5,71.9 11.5,72.9 14.75,73.65 12.75,73.65
  pour Bottom: 11.1,51.9 13.5,51.9 13.5,44.1 11.7,44.1 11.7,49.7 11.1,50.3
  pour Top: 11.7,44.1 11.7,46.5 13.5,46.5 13.5,44.1
  pour Bottom (rank 3): 15,67.5 10.85,67.5 10.85,74.7 15,74.7
  pour Top (rank 3): 15,67.5 10.85,67.5 10.85,74.7 15,74.7
15.UART1_RXD  (via drill 0.2)
  Top 0.102: U2.7 83.2,53.95 v83.2,54
  Bottom 0.102: RP1.1 arc90 83.5,54 v83.2,54
15.UART1_TXD  (via drill 0.2)
  Top 0.102: U2.5 82.6,52.3 v83,51.9
  Bottom 0.102: v83,51.9 83,53.4 83.05,53.45 RP1.2
15.UART2_RXD  (via drill 0.2, 0.2 pad 0.46)
  Top 0.102: U2.10 81.5,54.1 v81.1,54.5
  Bottom 0.102: v7.25,33.35 6,33.35 5.77,33.58 5.77,36.52 IC3.4 | v81.1,54.5 80.8,54.5 RP2.4
15.UART2_TXD  (via drill 0.2, 0.2 pad 0.46)
  Top 0.102: v10.7,35.55 10.65,35.5 IC2.2 | U2.2 80.75,52.5 v80.75,51.75
  Bottom 0.102: v80.75,51.75 80.7,51.8 80.7,53.25 80.55,53.4 RP2.3
15.VLOGIC_OUT_VLOGIC  (via drill 0.2 pad 0.46)
  Top 0.254: IC2.1 10,34.35 v10.05,34.3
  Bottom 0.254: IC2.1 C80.1 10,34.35 v10.05,34.3 | 7.65,37.2 IC3.5 7.7,37.05 C83.1 | IC2.1 10.05,34.95 | IC2.1 9.95,35.05 9.05,35.05 8.41,35.69 | 8.44,37.02 C83.1 | 8.41,35.69 C83.1 | 8.41,35.69 7.94,35.69 IC3.1
16.3.3V_VCC_3.3  (via drill 0.2, 0.2 pad 0.46)  (1 unrouted)
  Top 0.254: U1.15 v81.5,41.95 | U1.10 v84,42.05 | U1.23 78.2,38.6 v78.15,38.65 77.81,38.65 C5.1 | U1.36 85.2,35.85 v85.8,35.25 | R3.2 v76.65,37.7 | U1.5 86,38.6 86.85,39.45 v86.85,39.7 | 77.74,34.96 v77.65,35.05 | R2.1 77.56,35.14 v77.65,35.05 | C6.1 78.14,34.56 v77.65,35.05
  Top 0.305: U1.29 80.5,35.3 79.5,34.3 C6.1
  Bottom 0.254: C7.1 85.64,35.41 v85.8,35.25 | C8.1 80.17,41.39 C4.1 v81.5,41.94 v81.5,41.95 | C3.1 84.51,42.05 v84,42.05 | C9.1 79.4,42.5 v79.4,41.95 | C2.1 84.91,39.16 85.7,39.95 86.6,39.95 v86.85,39.7
  Bottom 0.406: R38.2 29.79,67.89 Q3.3
  pour Power: 76,31.1 89,31.1 89,43.1 76,43.1
16.GPIO23_GPIO  (via drill 0.2)
  Top 0.254: R29.2 109.1,77.95 v109.25,77.95
  Bottom 0.254: v109.25,77.95 R27.1
16.HDMI0_CEC  (via drill 0.2)
  Top 0.102: U$26.2 93.2,53.3 v92.8,53.7
  Bottom 0.102: RP3.4 93.6,53.7 v92.8,53.7
16.HDMI0_CLOCK_N  (via drill 0.2)
  Top 0.2: L8.2 96.03,56.67 96,56.7 93,56.7 v93,56.57
  Bottom 0.2: v93,56.57 93,56.7 93.5,56.7 93.93,57.12 U5.9
16.HDMI0_CLOCK_P  (via drill 0.2)
  Top 0.2: L8.3 96.03,57.23 96,57.2 93,57.2 v93,57.33
  Bottom 0.2: 94.6,57.8 U5.10 93.87,57.77 93.3,57.2 93,57.2 v93,57.33
16.HDMI0_D0_N  (via drill 0.2)
  Top 0.2: L7.2 96.03,58.23 96,58.25 93,58.25 v93,58.12
  Bottom 0.2: 94.6,58.45 U5.11 | U5.11 94.17,58.42 94.1,58.5 | U5.11 93.68,58.42 93.5,58.25 93,58.25 v93,58.12
16.HDMI0_D0_P  (via drill 0.2)
  Top 0.2: L7.3 96.03,58.77 96,58.75 93,58.75 v93,58.88
  Bottom 0.2: U5.12 94.6,59.05 94.15,59.05 94.1,59 93.55,59 93.3,58.75 93,58.75 v93,58.88
16.HDMI0_D1_N  (via drill 0.2)
  Top 0.2: L2.2 96.03,59.77 96,59.8 93,59.8 v93,59.67
  Bottom 0.2: 94.6,59.75 U5.13 93.78,59.73 93.7,59.8 93,59.8 v93,59.67
16.HDMI0_D1_P  (via drill 0.2)
  Top 0.2: L2.3 96.03,60.33 96,60.3 93,60.3 v93,60.43
  Bottom 0.2: 94.6,60.35 U5.14 93.67,60.38 93.6,60.3 93,60.3 v93,60.43
16.HDMI0_D2_N  (via drill 0.2)
  Top 0.2: L1.2 96.2,61.35 93,61.35 v93,61.22
  Bottom 0.2: 94.6,61 U5.15 93.72,61.02 93.4,61.35 93,61.35 v93,61.22
16.HDMI0_D2_P  (via drill 0.2)
  Top 0.2: L1.3 96.2,61.85 93,61.85 v93,61.98
  Bottom 0.2: 94.6,61.65 U5.16 | v93,61.98 93,61.85 93.6,61.85 93.8,61.65 94.6,61.65 | 94.6,61.65
16.HDMI0_DDC_SCL  (via drill 0.2)
  Top 0.102: U$26.3 93,52.8 v92.8,53
  Bottom 0.102: RP3.3 94.2,52.1 93.3,53 v92.8,53
16.HDMI0_DDC_SDA  (via drill 0.2)
  Top 0.102: U$26.4 v92.8,52.3
  Bottom 0.102: RP3.2 94.2,51.6 93.5,52.3 v92.8,52.3
16.HDMI0_HPD  (via drill 0.2)
  Top 0.102: U$26.5 93,51.8 v92.8,51.6
  Bottom 0.102: RP3.1 94.2,51.1 93.7,51.6 v92.8,51.6
16.nRESET_NRESET  (via drill 0.2)
  Bottom 0.254: C94.1 87.63,79.75 R23.2 87.67,79.32 v88.02,78.97
16.SYS_EN_SYSEN  (via drill 0.2)  (2 unrouted)
  Top 0.102: J1.100 v33.7,67.1
  Top 0.254: R30.2 109.35,68.6 v109.35,68.45
  Bottom 0.102: v33.7,67.1 33.7,65.2 Q1.1
  Bottom 0.254: v109.35,68.45 R35.1
16.UART0_RXD  (via drill 0.2)
  Top 0.102: U2.9 v81.95,54.8
  Bottom 0.102: RP2.5 82.5,53.9 RP1.8 82.55,54.2 v81.95,54.8
16.UART0_TXD  (via drill 0.2)
  Top 0.102: U2.3 81.55,51.8 v81.5,51.75
  Bottom 0.102: RP2.6 81.95,53.4 | 81.95,53.4 82.5,53.4 RP1.7 | v81.5,51.75 81.6,51.75 81.9,52.05 81.9,53.35 81.95,53.4
16.USB3_CC1_GPIO  (via drill 0.2)
  Bottom 0.254: C95.1 97.13,79.75 R26.2 97.17,79.32 v97.52,78.97
16.USB3_CC2_GPIO  (via drill 0.2)
  Top 0.102: U2.4 81.95,51.7 82.3,51.35 83.85,51.35 84.2,51.7 84.2,52.5 84.1,52.6 R33.2 83.94,53.06 83.65,53.35 83.65,53.9 83.8,54.05 v83.8,54.6 82.85,54.6 U2.8
16.USB_HOST_D_N  (via drill 0.2 pad 0.46)
  Top 0.2: v78.47,32.1 78.6,32.23 78.6,32.67 81.05,35.12 81.05,35.8 U1.30
16.USB_HOST_D_P  (via drill 0.2 pad 0.46)
  Top 0.2: v79.13,32.1 79,32.23 79,32.48 81.45,34.93 81.45,35.8 U1.31
16.USB_HOST_DRV_VBUS  (via drill 0.2)
  Bottom 0.254: IC1.2 87.8,38.6 88.1,38.6 88.45,38.95 v88.45,39.1
16.USB_HOST_VBUS  (via drill 0.2)
  Bottom 0.305: v87,35.6 87.39,35.99 R9.1 87.39,37.01 86.6,37.8 IC1.4
16.VLOGIC_VLOGIC  (via drill 0.2)
  Top 0.254: U$26.1 94.5,55.25 v95.3,56.05 | U$26.8 96.42,50.58 v96.7,50.3 | U2.1 80.8,53.4 80.65,53.55 80.65,54.02 80.64,54.02 C105.1 | v80,54.75 80.25,54.75 80.55,54.45 80.55,54.12 80.64,54.12 C105.1 | R34.1 80.64,53.4 C105.1
  Top 0.305: C102.1 U$26.8
  Bottom 0.254: R22.2 90,79.82 v90.41,79.41 | R25.2 99.5,79.82 v99.91,79.41 | C111.1 v97.15,62.85 95.45,62.85 v95.35,62.75 C104.1 | C103.1 v95.3,56.05
  pour Power (rank 6): 105.5,65.8 92.5,65.8 92.5,49.3 105.5,49.3
21.USBH1_D_N  (via drill 0.2 pad 0.46)
  Top 0.2: U1.1 87.3,36.6 87.75,36.15 87.75,35.1 v87.8,35.1
21.USBH1_D_P  (via drill 0.2 pad 0.46)
  Top 0.2: U1.2 87.52,37.1 88.3,36.32 v88.3,35.6
21.USBH1_DRV_VBUS  (via drill 0.2, 0.2 pad 0.46)
  Top 0.203: U1.12 v83,42.6
  Bottom 0.305: U8.3 109,38.33
  Bottom 0.406: 109,38.33 v109,37.2
21.USBH1_NOC  (via drill 0.2, 0.2 pad 0.46)
  Top 0.203: v82.5,42.1 U1.13
  Bottom 0.305: U8.8 110.35,42.58
  Bottom 0.406: 110.35,42.58 110.35,45 110.2,45.15 v110.15,45.15
21.USBH1_VBUS  (via drill 0.2)
  Bottom 0.305: U8.7 109.65,42.58
  Bottom 0.406: 109.65,42.58 v109.65,44.5 108.95,45.2 D3.P2 105.88,45.17 FB4.2
21.USBH2_D_N  (via drill 0.2 pad 0.46)
  Top 0.2: U1.3 84.8,37.65 88.37,37.65 v88.5,37.52
21.USBH2_D_P  (via drill 0.2 pad 0.46)
  Top 0.2: U1.4 84.8,38.05 88.37,38.05 v88.5,38.18
21.USBH2_DRV_VBUS  (via drill 0.2, 0.2 pad 0.46)
  Top 0.203: U1.16 v81,42.6
  Bottom 0.406: U8.4 v107.9,38.35
21.USBH2_NOC  (via drill 0.2, 0.2 pad 0.46)
  Top 0.203: U1.17 80.5,42.05 v80.45,42.1
  Bottom 0.406: U8.5 v107.85,42.55
21.USBH2_VBUS  (via drill 0.2)
  Bottom 0.305: U8.6 109,42.58
  Bottom 0.406: 109,42.58 v109,43.75 108.7,44.05 107.95,44.05 106.6,42.7 D7.P2 105.3,42.1 104.7,41.5 104.7,32.85 104.43,32.58 FB3.2
!RPIBOOT$16  (via drill 0.2)  (1 unrouted)
  Top 0.102: J1.93 v34.9,71.8
  Bottom 0.102: v34.9,71.8 34.7,72 27.9,72 27.7,71.8 S1.4
  Bottom 0.254: S1.4 S1.3
A0$16
  Bottom 0.102: IC5.1 53.58,66.08 R43.2
A1$16
  Bottom 0.102: IC5.2 53.68,65.42 R42.2
A2$16
  Bottom 0.102: IC5.3 53.53,64.78 R41.2
A_GNDF$20  (via drill 0.2)
  Top 0.406: K1.B4 98.35,42.1 104,36.45 104,35.05 v105.6,33.45
  Bottom 0.254: C113.1 106.61,32.88 FB1.2 v105.6,33.45 D4.P2
  Bottom 0.406: K1.A4 K1.B4
A_USB_D_N$20
  Top 0.2: L3.1 93.28,38.09 93.53,38.35 95.05,38.35 95.57,37.83 K1.A2
  Bottom 0.406: D1.P2 95.27,37.9 K1.A2
A_USB_D_P$20
  Top 0.2: L3.4 92.72,38.11 93.37,38.75 95.05,38.75 95.57,39.27 K1.A3
  Bottom 0.406: D2.P2 95.22,39.25 K1.A3
A_VBUS_$20
  Bottom 0.61: K1.A1 96.45,35.1 97.7,36.35 98.65,36.35 99.35,37.05 99.35,38.65 99.65,38.95 100.05,39.35 100.35,39.65 C115.1 C116.1 101,41.95 101.2,42.15 101.2,42.65 102.6,44.05 FB4.1
ANODE$12
  Top 0.254: D14.A 106.47,75.4 R28.1
ANODE$13
  Top 0.254: D8.A 106.8,71.23 R31.1
B_USB_D_N$20
  Top 0.2: K1.B2 97.3,37.6 96.7,38.2 96.7,40.12 96.27,40.55 93.12,40.55 92.72,40.94 L4.1
  Bottom 0.406: D5.P2 96.05,36.35 97.3,37.6 K1.B2
B_USB_D_P$20
  Top 0.2: K1.B3 97.45,39.6 97.1,39.95 97.1,40.28 96.43,40.95 93.28,40.95 93.24,40.99 93.24,41.59 L4.4
  Bottom 0.406: K1.B3 96.84,40.95 D6.P2
B_VBUS_$20  (via drill 0.2)
  Top 0.406: v102.9,32.8 102.9,34.6 102.35,35.15 98.24,35.15 K1.B1
  Bottom 0.406: v102.9,32.8 102.9,32.62 FB3.1
  Bottom 0.61: K1.B1 100.6,35.1 C118.1 C117.1
BOOT$2
  Bottom 0.254: U6.1 10.3,45.11 11,45.81 C52.1
BTN_A$10  (via drill 0.2)
  Top 0.254: S2.B@2 v90.26,81.59
  Bottom 0.254: v90.26,81.59 89.55,80.88 D12.P2 88.75,80.84 88.75,80.1 88.88,79.97 | R22.1 89.03,79.82 88.88,79.97 | R23.1 88.61,79.71 88.88,79.97
BTN_A$11  (via drill 0.2)
  Top 0.254: S3.B@2 v99.76,81.59
  Bottom 0.254: v99.76,81.59 99.05,80.88 D13.P2 98.25,80.84 98.25,80.1 98.38,79.97 | R25.1 98.53,79.82 98.38,79.97 | R26.1 98.11,79.71 98.38,79.97
CEC$14  (via drill 0.2)
  Top 0.102: U$26.13 96.7,53.58 v96.7,54.1 96.7,54.95 97.85,56.1 U3.13
  Bottom 0.102: v102.5,62.3 101.55,62.3 100.92,61.67 U5.1 98.83,61.67 97.55,60.4 97.55,55.6 96.7,54.75 v96.7,54.1 96.7,53.6 RP3.5
COMMON_SHIELD  (via drill 0.2)
  Top 0.406: U3.G3 U3.G2 | U3.G1 U3.G4 | v99.45,43.1 101.45,41.1 v105.6,41.1 105.6,43.45 v103.85,45.2
  Bottom 0.406: D4.P1 v105.6,41.1 105.7,41 D7.P1 | D5.P1 D1.P1 D2.P1 D6.P1 93.2,41.3 94.05,42.15 94.05,42.8 94.55,43.3 99.25,43.3 v99.45,43.1 | D3.P1 v103.85,45.2
  other vias: 12.5,75.9 11.5,75.9 10.5,75.9 9.5,75.9 8.55,75.9 7.55,75.85 6.55,75.85 5.65,75.85 4.65,75.9 3.85,75.9 3.1,75.9 2.35,75.9
  pour Bottom (rank 4): 15,75.1 6.75,75.1 6.75,73.75 2,74 1.95,76.4 15,76.4
  pour Top (rank 4): 15,75.1 1.95,75.1 1.95,76.4 15,76.4
  pour Top: 111,66.3 111,48.8 106,48.8 106,66.3
  pour Bottom: 111,66.3 111,48.8 106,48.8 106,66.3
  pour GND: 111,66.3 111,48.8 106,48.8 106,66.3
  pour S3: 111,66.3 111,48.8 106,48.8 106,66.3
  pour S14: 111,66.3 111,48.8 106,48.8 106,66.3
  pour Power: 111,66.3 111,48.8 106,48.8 106,66.3
CON_5V0$14  (via drill 0.2)
  Top 0.254: v102.2,58.05 103.2,57.05 103.2,54.2 102.55,53.55 101.45,53.55 101.4,53.6 U3.18 98.45,53.6 98.1,53.95 v98.1,54.1
  Bottom 0.254: U5.6 101.17,58.42 101.55,58.05 v102.2,58.05 | C101.1 98.1,53.91 v98.1,54.1
DDC_SCL$14  (via drill 0.2)
  Top 0.102: U$26.12 97.6,52.8 v97.7,52.9 97.7,53.45 97.4,53.75 97.4,54.55 97.95,55.1 U3.15
  Bottom 0.102: v102.5,61.55 101.97,61.02 U5.2 98.72,61.02 97.8,60.1 97.8,55.55 97.5,55.25 97.5,53.1 v97.7,52.9 97.6,52.8 97,52.8 96.3,52.1 RP3.6
DDC_SDA$14  (via drill 0.2)
  Top 0.102: U$26.11 v97.9,52.3 98.15,52.55 98.15,53.3 97.65,53.8 97.65,54.35 97.9,54.6 U3.16
  Bottom 0.102: RP3.7 96.3,51.6 97,52.3 v97.9,52.3 98.6,52.3 99.5,53.2 99.5,54.45 98.8,55.15 98.8,59.85 99.33,60.38 U5.3
DS_LOAD$16
  Bottom 0.61: Q3.2 Q2.2
DS_LOAD_1V8$16  (1 unrouted)
FB_3.3$3
  Bottom 0.254: IC4.10 80.51,72.08 R21.1 80.09,71.66 C91.2 80.09,69.42 R24.2
FTDI_3.3_INT$1
  Top 0.254: IC2.16 5.95,39.45 5.85,39.55 5.85,39.75 C82.1
GATE$12
  Bottom 0.254: R27.2 108.7,75.05 Q6.1
GATE$13
  Bottom 0.254: R35.2 106.45,69 Q4.1
GND  (via drill 0.2, 0.2 pad 0.25, 0.2 pad 0.41, 0.2 pad 0.46)  (1 unrouted)
  Top 0.254: IC2.24 5.4,34.29 5.42,34.27 5.42,33.86 5.53,33.75 6.3,33.75 6.45,33.9 IC2.26 | v10.6,36.5 IC2.4 | C82.2 5.31,39.72 5.25,39.66 v5.25,39.1 5.25,38.65 IC2.17 | v4.45,36.55 4.7,36.8 C84.2 4.74,37 IC2.20 | S2.A@1 v85.85,79.15 | S3.A@1 v95.35,79.15 | U3.11 v101.75,57.1 | U3.8 v101.75,58.6 | U3.5 v101.75,60.1 | U3.2 v101.75,61.6 | U3.17 v101.75,54.1 | C107.2 95.41,55.21 v95.6,55.4 | U$26.7 v94.5,49.8 94.6,49.7 C102.2 | U2.6 83.15,53 83.7,52.45 v83.7,51.85 | v84.3,54.05 84.3,53.84 R33.1 | J1.32 v47.3,69.1 | J1.22 49.3,69.1 | J1.14 50.9,69.1 | J1.8 52.1,69.1 | J1.1 53.3,70.1 | J1.7 52.1,70.1 | J1.13 50.9,70.1 | J2.8 52.1,35.1 | J2.14 50.9,35.1 | J2.20 49.7,35.1 | J2.7 52.1,36.1 | J2.13 50.9,36.1 | J2.19 49.7,36.1 | J2.25 48.5,36.1 | J2.31 47.3,36.1 | J2.26 48.5,35.05 | J2.32 47.3,35.1 | J2.38 46.1,35.1 | J2.44 44.9,35.1 | J2.37 46.1,36.1 | J2.50 43.7,35.1 | J2.56 42.5,35.1 | J2.62 41.3,35.1 | J2.55 42.5,36.1 | J2.61 41.3,36.1 | J2.67 40.1,36.1 | J2.68 40.1,35.1 | J2.74 38.9,35.1 | J2.73 38.9,36.1 | J2.79 37.7,36.1 | J2.85 36.5,36.1 | J2.91 35.3,36.1 | J2.92 35.3,35.1 | J2.86 36.5,35.1 | J2.80 37.7,35.1 | J2.98 34.1,35.1 | J2.97 34.1,36.1 | J1.2 53.3,69.1
  Bottom 0.254: C80.2 10,35.75 10.6,36.35 v10.6,36.5 | C110.2 4.5,51.35 C30.2 | IC4.11 83.3,72.72 IC4.P$1 | IC4.12 83.3,73.38 IC4.P$1 | 84.28,73.38 IC4.16 | 84.28,73.38 IC4.1 | IC4.P$1 84.28,73.38 | IC4.9 82.33,71.42 82.85,71.95 | 82.85,71.95 IC4.P$1 | IC4.7 82.97,71.83 82.85,71.95 | 83.62,71.8 83.62,72.08 IC4.P$1 | 83.62,71.8 IC4.6 | IC4.5 84.28,71.15 83.62,71.8 | v85.85,79.15 85.85,80.1 86.08,80.33 C94.2 87.12,80.88 D12.P1 87.61,81.68 v87.59,81.7 | v95.35,79.15 95.35,80.1 95.58,80.33 C95.2 96.62,80.88 D13.P1 97.11,81.68 v97.09,81.7 | v101.75,57.1 102.13,56.72 R32.1 | C103.2 v93.9,56.05 | C101.2 99,54.3 98.3,55 v98.3,55.55 | C104.2 v93.95,62.75 | C106.2 v103.85,59.75 | C109.2 45.24,65.66 v45.3,65.6 | IC1.3 87.35,37.8 86.8,38.35 v86.8,38.6
  Bottom 0.406: Q6.2 106.65,74.65 v105.9,74.65 | Q4.2 106.05,71.05 v106.05,71.8
  Bottom 0.61: U6.6 6.87,52.28 C110.2
  other vias: 10.2,39.25 6.42,33.8 4,44.35 12.75,60.85 2.25,60.85 6.9,47.25 8.1,47.25 8.1,48.55 6.9,48.55 80.5,66.65 81,66.65 85,70.1 85,70.6 84.5,74.6 19.5,10.8 22.6,6.7 19.25,20.35 23,23.6 80.25,51.35 54,68.1 33.75,35.6 42.5,35.6 52.1,35.6 54,71.1 102.6,46.55 103.6,33.5 102.05,39.85 105.6,31.35 85.6,34.05 86.25,42 81.25,39.35 82,39.35 82.75,39.35 83.5,39.35 80.5,39.35 81.25,38.6 81.25,37.85 81.25,37.1 82,37.85 82.75,37.85 83.5,37.85 82.75,38.6 82.75,37.1 80.5,37.85 81.25,40.1 82.75,40.1
  pour Top (rank 6): 0,0 0,85.1 111,85.1 111,0
  pour GND (rank 6): 0,0 0,85.1 111,85.1 111,0
  pour Bottom (rank 6): 0,0 0,85.1 111,85.1 111,0
  pour Top (isolate 0.254): 3.5,32.6 11,32.6 11,41.1 3.5,41.1
  pour Bottom: 3.5,32.6 11,32.6 11,41.1 3.5,41.1
  pour GND: 3.5,32.6 11,32.6 11,41.1 3.5,41.1
  pour Top (rank 2): 1.5,43.6 13.5,43.6 13.5,61.6 1.5,61.6
  pour Bottom (rank 2): 1.5,43.6 13.5,43.6 13.5,61.6 1.5,61.6
  pour Bottom (rank 2): 84.2,74.8 85.8,74.8 85.8,73.3 84.4,73.3 84.4,71 85.58,71 86.15,70.43 86.15,69.09 85.46,68.4 83.66,68.4 82.9,69.16 82.9,71.3 81.8,71.3 81.8,69 80.9,69 80.8,73.7 84.2,73.7
  pour Top (rank 2): 87.5,66.1 78,66.1 78,75.6 87.5,75.6
  pour Bottom (rank 5): 15,64.4 0,64.4 0,76.4 15,76.4
  pour Top (rank 5): 15,64.4 0,64.4 0,76.4 15,76.4
  pour Top (rank 5): 101,3.1 101,26.1 12,26.1 12,3.1
  pour Bottom (rank 5): 101,3.1 101,26.1 12,26.1 12,3.1
  pour GND: 110.1,73.4 110.1,78.9 105.1,78.9 105.1,73.4
  pour Top (rank 6): 105.1,73.4 105.1,78.9 110.1,78.9 110.1,73.4
  pour Bottom (rank 6): 105.1,73.4 105.1,78.9 110.1,78.9 110.1,73.4
  pour GND: 104.8,67.6 110.3,67.6 110.3,72.6 104.8,72.6
  pour Top (rank 6): 104.8,72.6 110.3,72.6 110.3,67.6 104.8,67.6
  pour Bottom (rank 6): 104.8,72.6 110.3,72.6 110.3,67.6 104.8,67.6
  pour Top (rank 6): 105.5,65.8 105.5,49.3 92.5,49.3 92.5,65.8
  pour Bottom (rank 6): 105.5,65.8 105.5,49.3 92.5,49.3 92.5,65.8
  pour GND (rank 6): 105.5,65.8 92.5,65.8 92.5,49.3 105.5,49.3
  pour GND: 79.5,51.1 84.5,51.1 84.5,55.1 79.5,55.1
  pour Top: 79.5,55.1 84.5,55.1 84.5,51.1 79.5,51.1
  pour Top (rank 5): 19,33.1 73,33.1 73,72.1 19,72.1
  pour Bottom (rank 5): 19,33.1 73,33.1 73,72.1 19,72.1
  pour Top: 71.4,85.09 21.6,85.1 21.6,74.59 71.4,74.59
  pour GND: 71.4,85.09 21.6,85.1 21.6,74.59 71.4,74.59
  pour Bottom: 71.4,85.09 21.6,85.1 21.6,74.59 71.4,74.59
  pour Top (rank 6): 92.5,46.6 92.5,30.6 111,30.6 111,46.6
  pour Bottom (rank 6): 92.5,46.6 92.5,30.6 111,30.6 111,46.6
  pour GND: 92.5,46.6 92.5,30.6 111,30.6 111,46.6
  pour Top (rank 2): 76,43.1 89,43.1 89,31.1 76,31.1
  pour Bottom (rank 2): 76,43.1 89,43.1 89,31.1 76,31.1
  pour GND: 76,43.1 89,43.1 89,31.1 76,31.1
GPIO_VREF$16  (via drill 0.2)
  Top 0.254: J1.78 v38.1,69.1
  Bottom 0.254: v38.1,69.1 38.1,66 | 38.1,66 37.9,65.8 R44.2 R37.2 | R43.1 54.25,66.24 54.25,66.6 54.05,66.8 47.8,66.8 47.08,66.08 IC5.8 46.21,66.24 C109.1 44.34,66.24 44.2,66.1 | R45.2 R10.2 44.2,66.1 | 44.2,66.1 38.2,66.1 38.1,66
HPD$14  (via drill 0.2)
  Top 0.102: U$26.10 97.5,51.8 v97.7,51.6 98.54,51.6 U3.19
  Bottom 0.102: v102.5,60.05 102,59.55 101.55,59.55 101.38,59.73 U5.4 99.28,59.73 99.05,59.5 99.05,55.25 99.75,54.55 99.75,53.15 98.2,51.6 v97.7,51.6 96.95,51.6 96.45,51.1 RP3.8
ID_SC$16  (via drill 0.2)  (1 unrouted)
  Top 0.102: J1.35 v46.5,69.6 | v46,66.85 46,65.35 v45.5,64.85
  Bottom 0.102: IC5.6 46.3,64.85 v45.5,64.85 44.84,64.85 R10.1 | v46.5,69.6 46.5,67.35 v46,66.85
ID_SD$16  (via drill 0.2)  (1 unrouted)
  Top 0.102: J1.36 46.5,64.25 IC5.5 45.52,64.12 v45.5,64.1
  Bottom 0.102: IC5.5 46.35,64.1 v45.5,64.1 44.89,64.1 R45.1
LED-$12  (via drill 0.2 pad 0.46)
  Top 0.406: D14.C 107.6,77.75 v107.2,78.15
  Bottom 0.406: Q6.3 107.6,77.75 v107.2,78.15
LED-$13  (via drill 0.2 pad 0.46)
  Top 0.406: D8.C 109.15,70.1 v109.55,70.5
  Bottom 0.406: Q4.3 109.15,70.1 v109.55,70.5
LOAD_GATE$16  (2 unrouted)
  Bottom 0.254: Q1.3 Q2.1 31.6,69.2 29.65,69.2 29.05,69.8 Q3.1
PG_3.3$3
  Bottom 0.254: IC4.13 80.62,74.38 80.09,73.84 R19.1
PH$2  (via drill 0.2)
  Top 0.61: L6.1 11.12,58.6 v12.5,58.6 | L6.1 11.12,57.6 v12.5,57.6 | 11.12,56.6 v12.5,56.6 | L6.1 11.12,56.6 | 11.12,56.6 11.12,55.95 | 11.12,55.95 11.12,55.6 | 11.12,55.6 v12.5,55.6 | 11.12,55.6 11.12,54.6 v12.5,54.6 | v10.45,51.1 10.45,55.28 11.12,55.95
  Bottom 0.254: C52.2 11,48 9.9,49.1 9.9,50.55 10.04,50.69
  Bottom 0.61: U6.8 10.04,50.69 v10.45,51.1 v10.45,51.7
  pour Bottom: 9,59.1 13,59.1 13,54 9,54
  pour Bottom: 9,51.9 10.7,51.9 10.7,49.8 9,49.8
RPIBOOT_SWITCH$16
  Bottom 0.254: S1.1 S1.2 R11.2
RX_SW$1  (via drill 0.2 pad 0.46)
  Top 0.102: 8.45,34.33 IC2.30
  Top 0.254: 8.45,34.33 8.46,34.32 v8.46,33.84
  Bottom 0.254: IC3.2 7,34.9 8.06,33.84 v8.46,33.84
SUSCLK_32KHZ$5
  Top 0.305: Q5.3 23.77,18.48 20.75,21.5 20.75,22.07 U7.68
SW_3.3$3  (via drill 0.2 pad 0.25)
  Bottom 0.254: v83,75.1 82.97,75.1
  Bottom 0.406: 82.97,75.1 IC4.14
  other vias: 82,75.1 83.5,75.1 81.5,75.1
  pour Top: 83.7,75.45 80.42,75.45 79.5,74.53 79.5,73.1 83.7,73.1
  pour Bottom: 83.7,74 81,74 81,75.45 83.7,75.45
TXD0_CONN_N$14
  Top 0.2: U3.9 98.15,58.1 98,58.25 97.5,58.25 L7.1
TXD0_CONN_P$14
  Top 0.2: U3.7 98.35,59.1 98,58.75 97.5,58.75 L7.4
TXD1_CONN_N$14
  Top 0.2: U3.6 98.3,59.6 98.1,59.8 97.5,59.8 L2.1
TXD1_CONN_P$14
  Top 0.2: U3.4 98.4,60.6 98.1,60.3 97.5,60.3 L2.4
TXD2_CONN_N$14
  Top 0.2: U3.3 98.45,61.1 98.2,61.35 97.5,61.35 L1.1
TXD2_CONN_P$14
  Top 0.2: U3.1 98.45,62.1 98.2,61.85 97.5,61.85 L1.4
TXDC_CONN_N$14
  Top 0.2: U3.12 98.1,56.6 98,56.7 97.5,56.7 L8.1
TXDC_CONN_P$14
  Top 0.2: U3.10 98.4,57.6 98,57.2 97.5,57.2 L8.4
USB_CRFILT$21  (via drill 0.2)
  Top 0.203: U1.14 v82,42.6
  Bottom 0.203: 82,41.54 v82,42.6
  Bottom 0.254: C13.1 82.78,41.49 C14.1 82,41.54
USB_HS_IND$21  (via drill 0.2)
  Top 0.203: v78.25,37.35 78.5,37.6 U1.25
  Bottom 0.254: R6.2 77.79,37.35 v78.25,37.35
USB_NRESET$21
  Top 0.2: 78.42,36.72 78.45,36.75 | C12.1 78.31,36.61 78.55,36.85
  Top 0.203: U1.26 78.8,37.1 78.55,36.85 78.45,36.75 | C12.1 R3.1
USB_PLLFILT$21  (via drill 0.2)
  Top 0.305: U1.34 83,34.9 83.65,34.25 v83.65,34.1
  Top 0.406: v83.65,34.1 84.07,34.1 C15.1
  Bottom 0.305: C1.1 83.7,34.05 v83.65,34.1
USB_RBIAS$21  (via drill 0.2)
  Top 0.305: U1.35 83.5,35.3 v83.9,34.9
  Bottom 0.305: v83.9,34.9 83.9,35.51 R4.2
USB_SCL$21  (via drill 0.2)
  Top 0.203: 79.2,38.05 U1.24 79.23,38.09 v78.55,38.09
  Bottom 0.254: R5.2 77.91,38.09 v78.55,38.09
USB_SDA$21  (via drill 0.2)
  Top 0.203: U1.22 79.2,39.15 v78.55,39.15
  Bottom 0.254: R8.2 78.55,39.56 v78.55,39.15
USB_SUSP_IND$21  (via drill 0.2)
  Top 0.203: v79.3,35.15 U1.28
  Bottom 0.203: R7.2 79.4,35.25 v79.3,35.15
USB_VBUS_DET$21  (via drill 0.2)
  Top 0.254: U1.27 79.25,36.55 v78.7,36 78.3,35.6 R2.2
USB_XTAL1$21  (via drill 0.2)
  Top 0.203: U1.33 v82.5,34.6 R1.2 | R1.2 | R1.2 82.5,33.55 v81.6,32.65
  Bottom 0.2: v82.5,34.6 82.5,35.31 C11.1
  Bottom 0.203: v81.6,32.65 81.75,32.65 Y1.3
USB_XTAL2$21  (via drill 0.2)
  Top 0.203: U1.32 v82,35.15 82,34.05 R1.1
  Bottom 0.2: 81.73,35.42 v82,35.15 81.65,35.5 C10.1
  Bottom 0.203: 81.95,35.15 v82,35.15 80.45,33.6 Y1.1
UTIL$14  (via drill 0.2)
  Top 0.102: U3.14 101.55,55.6 101.7,55.75 v102.5,55.75
  Bottom 0.102: U5.7 101.28,57.77 101.45,57.6 101.95,57.6 102.15,57.4 102.7,57.4 102.95,57.65 R32.2 103.47,57.68 103.6,57.55 103.6,56.2 103.15,55.75 v102.5,55.75
V_POWER$2
  Bottom 0.813: C30.1 3.7,53.1 3.7,54.2 4.3,54.8 8.2,54.8 8.95,54.05 C110.1
  Bottom 1.016: U6.7 8.13,52.19 C110.1 9.1,52.85 R18.2
VBUS$1  (via drill 0.2 pad 0.46)
  Top 0.254: 4.3,35.4 C81.1 3.8,36.05 v3.8,37.5 | IC2.18 IC2.19 4.7,37.5 C84.1 3.84,37.54 v3.8,37.5 | v3.8,37.5 3.81,37.52
  Bottom 0.254: v3.8,37.5 4.4,37.5 5.25,36.65 5.25,35.3 4.88,34.93 FB5.2
VBUSF$20
  Bottom 0.305: U8.2 109.65,38.33
  Bottom 0.406: 109.65,38.33 C114.1 FB2.2
VSENSE$2
  Bottom 0.254: U6.4 5.59,45.8
  Bottom 0.305: 5.59,45.8 5.41,45.98 4,45.98 R12.2 2.75,45.96 R17.1 2.75,45.98

## Text on the board
tPlace: 1 | 39
bPlace: P2 | P4 | P6 | P8 | P10 | P12 | P14 | P16 | P18 | P20 | P22 | P24 | P26 | P28 | P30 | P32 | P34 | P36 | P38 | P40 | P1 | P3 | P5 | P7 | P9 | P11 | P13 | P15 | P17 | P19 | P21 | P23 | P25 | P27 | P29 | P31 | P33 | P35 | P37 | P39 | BOOT